# EAGLE design D_cmp (EAGLE 7.2.0)
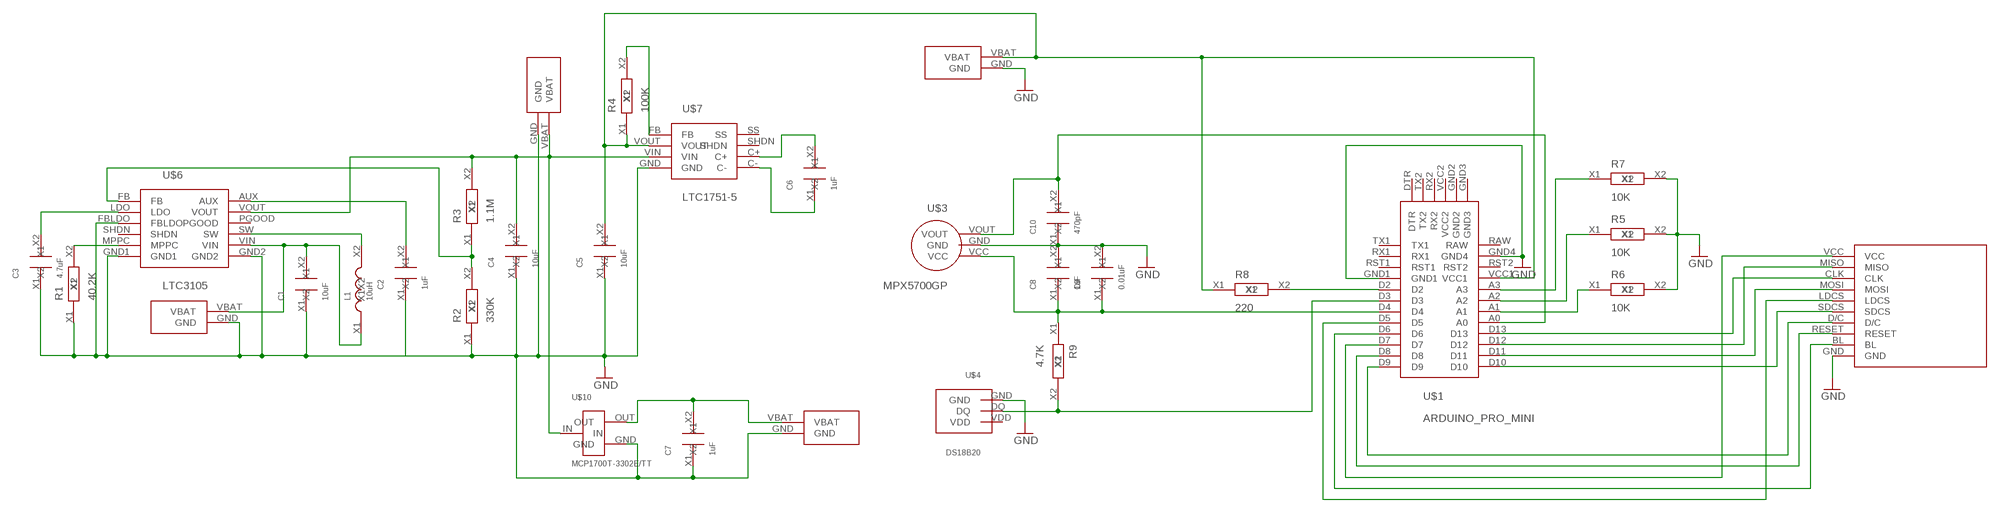
[diagram p0: schematic, sheet 1]

## Parts
C1  10uF  C_SMD_2.1X1.25  [SMD_2.1X1.25]
C2  1uF  C_SMD_2.1X1.25  [SMD_2.1X1.25]
C3  4.7uF  C_SMD_2.1X1.25  [SMD_2.1X1.25]
C4  10uF  C_SMD_2.1X1.25  [SMD_2.1X1.25]
C5  10uF  C_SMD_2.1X1.25  [SMD_2.1X1.25]
C6  1uF  C_SMD_2.1X1.25  [SMD_2.1X1.25]
C7  1uF  C_SMD_2.1X1.25  [SMD_2.1X1.25]
C8  1uF  C_SMD_2.1X1.25  [SMD_2.1X1.25]
C9  0.01uF  C_SMD_2.1X1.25  [SMD_2.1X1.25]
C10  470pF  C_SMD_2.1X1.25  [SMD_2.1X1.25]
L1  10uH  L_SMD_2.1X1.25  [SMD_2.1X1.25]
R1  40.2K  R_SMD_2.1X1.25  [SMD_2.1X1.25]
R2  330K  R_SMD_2.1X1.25  [SMD_2.1X1.25]
R3  1.1M  R_SMD_2.1X1.25  [SMD_2.1X1.25]
R4  100K  R_SMD_2.1X1.25  [SMD_2.1X1.25]
R5  10K  R_SMD_2.1X1.25  [SMD_2.1X1.25]
R6  10K  R_SMD_2.1X1.25  [SMD_2.1X1.25]
R7  10K  R_SMD_2.1X1.25  [SMD_2.1X1.25]
R8  220  R_SMD_2.1X1.25  [SMD_2.1X1.25]
R9  4.7K  R_SMD_2.1X1.25  [SMD_2.1X1.25]
U$1  ARDUINO_PRO_MINI  [ARDUINO_PRO_MINI]
U$2  TFT_LCD  [TFT_LCD]
U$3  MPX5700GP  [MPX5700GP]
U$4  DS18B20  [DS18B20]
U$5  BAT_PLUG  [BAT_PLUG]
U$6  LTC3105  [LTC3105]
U$7  LTC1751-5  [LTC1751-5]
U$8  BAT_PLUG  [BAT_PLUG]
U$9  BAT_PLUG  [BAT_PLUG]
U$10  MCP1700T-3302E/TT  [MCP1700T-3302E/TT]
U$11  BAT_PLUG  [BAT_PLUG]

## Nets
GND: C1.X1 C2.X1 C3.X1 C4.X1 C5.X1 C7.X1 C8.X2 C9.X2 C10.X1 R1.X1 R2.X1 R5.X2 R6.X2 R7.X2 U$1.GND1 U$1.GND4 U$2.GND U$3.GND U$4.GND U$5.GND U$6.FBLDO U$6.GND1 U$6.GND2 U$7.GND U$8.GND U$9.GND U$10.GND U$11.GND
N$1: U$1.D9 U$2.D/C
N$2: U$1.D8 U$2.RESET
N$3: U$1.D10 U$2.SDCS
N$4: U$1.D11 U$2.MOSI
N$5: U$1.D12 U$2.MISO
N$6: U$1.D13 U$2.CLK
N$7: U$1.D7 U$2.VCC
N$8: U$1.D6 U$2.BL
N$10: R6.X1 U$1.A1
N$11: R5.X1 U$1.A2
N$12: R7.X1 U$1.A3
N$14: R8.X2 U$1.D2
N$16: C8.X1 C9.X1 R9.X1 U$1.D4 U$3.VCC
N$17: R9.X2 U$1.D3 U$4.DQ
N$18: C10.X2 U$1.A0 U$3.VOUT
N$23: R1.X2 U$6.MPPC
N$26: C3.X2 U$6.LDO
N$28: L1.X2 U$6.SW
N$29: C2.X2 U$6.AUX
N$30: R2.X2 R3.X1 U$6.FB
N$31: C1.X2 L1.X1 U$6.VIN U$8.VBAT
N$32: C4.X2 R3.X2 U$6.VOUT U$7.VIN U$9.VBAT U$10.IN
N$33: C5.X2 R4.X1 R8.X1 U$1.VCC1 U$5.VBAT U$7.VOUT
N$34: R4.X2 U$7.FB
N$35: C6.X1 U$7.C-
N$36: C6.X2 U$7.C+
N$37: C7.X2 U$10.OUT U$11.VBAT
N$43: U$1.D5 U$2.LDCS
Unconnected: U$1.DTR U$1.GND2 U$1.GND3 U$1.RAW U$1.RST1 U$1.RST2 U$1.RX1 U$1.RX2 U$1.TX1 U$1.TX2 U$1.VCC2 U$4.VDD U$6.PGOOD U$6.SHDN U$7.SHDN U$7.SS

## Library data of the parts
C1-C10 = MyPowerComponents:C_SMD_2.1X1.25
L1 = MyPowerComponents:L_SMD_2.1X1.25
R1-R9 = MyPowerComponents:R_SMD_2.1X1.25
U$1 = MyDuino:ARDUINO_PRO_MINI
U$2 = MyDuino:TFT_LCD
U$3 = MyDuino:MPX5700GP
U$4 = MyDuino:DS18B20
U$5 U$8 U$9 U$11 = MyDuino:BAT_PLUG
U$6 = MyDuino:LTC3105
U$7 = MyPowerComponents:LTC1751-5
U$10 = MyDuino:MCP1700T-3302E/TT

## Board
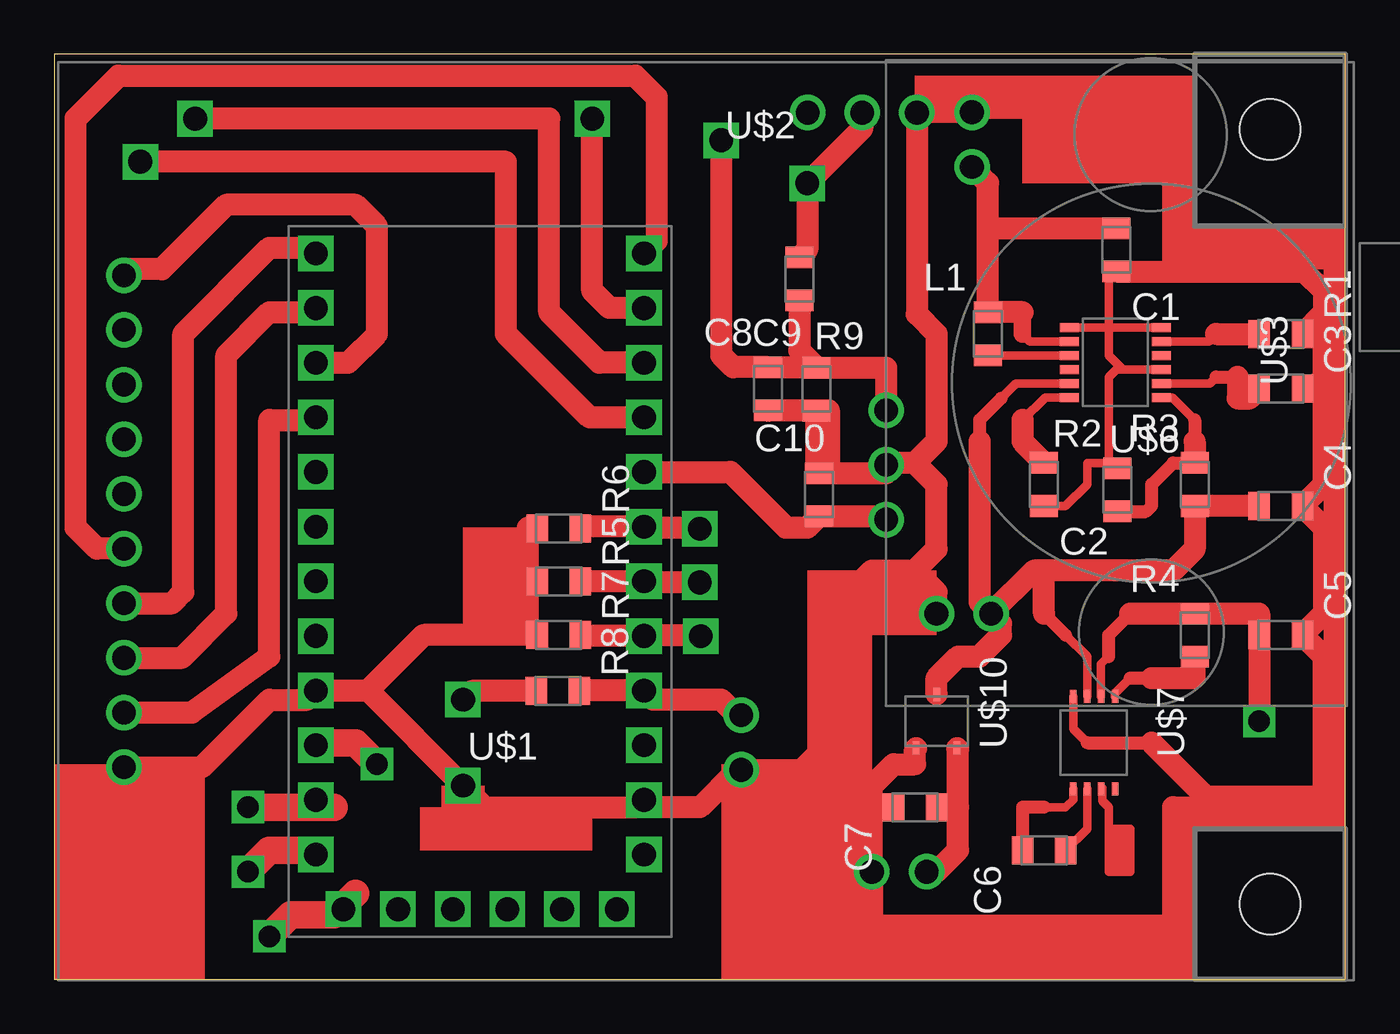
[diagram p1: board, top side]
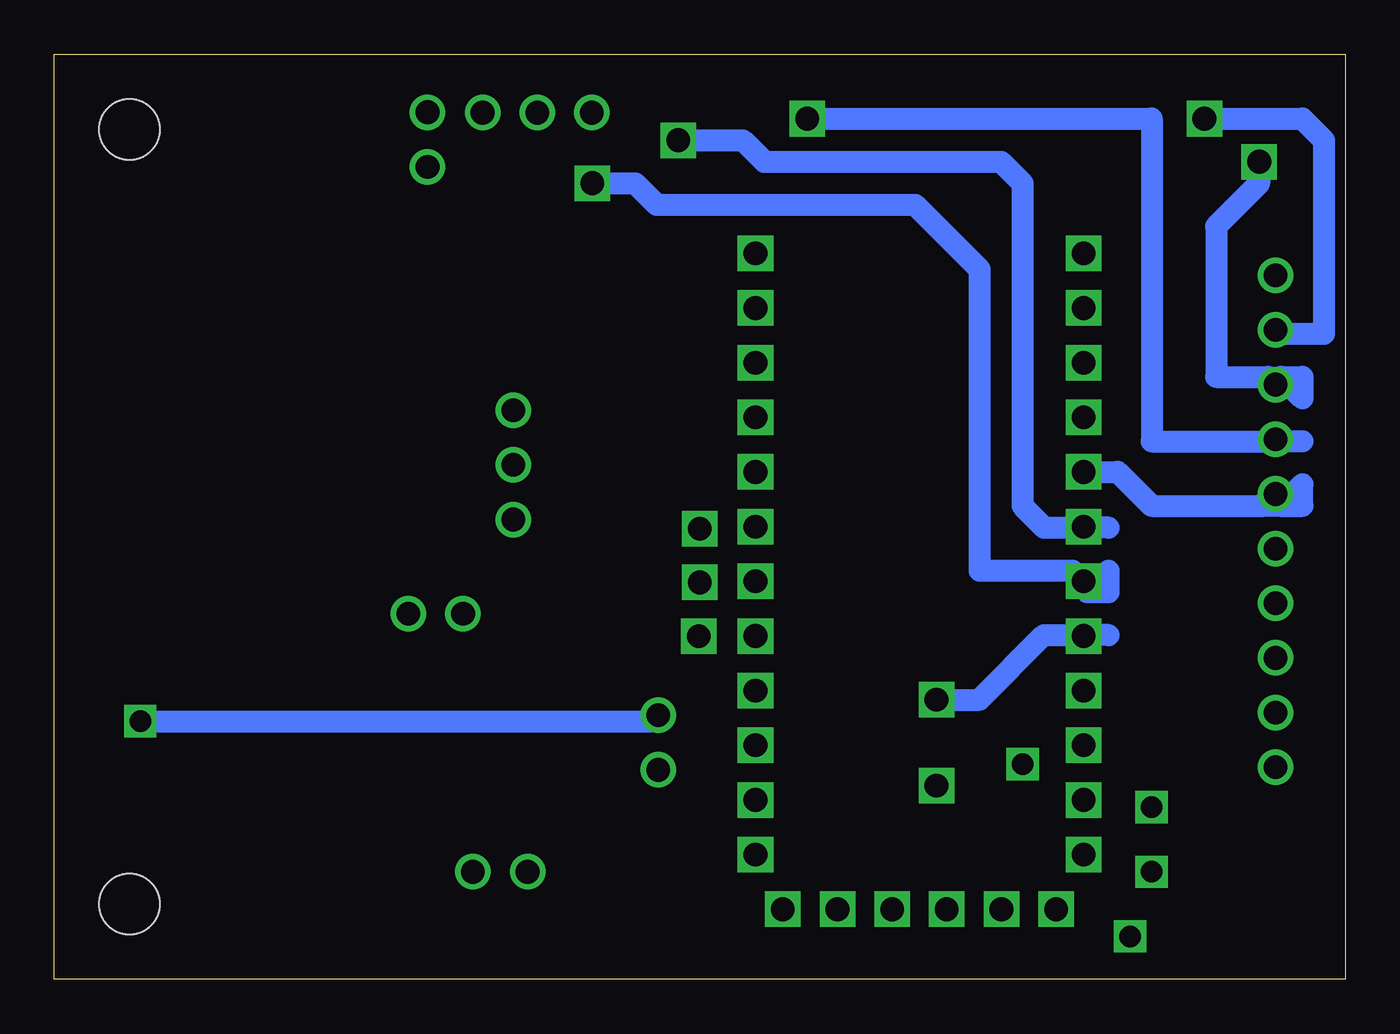
[diagram p2: board, bottom side, seen from below]

Size 60 x 43 mm. Coordinates in mm from the lower left corner, seen from the top.
Outline: 0,0 60,0 60,43 0,43 0,0
Copper layers (1*16): Top 0.035mm / dielectric 1.5mm / Bottom 0.035mm
Design rules "default": minimum track width 10mil, minimum drill 24mil, track to track 8mil, track to pad 8mil, pad to pad 8mil, via to via 8mil, smd to smd 8mil, copper to edge 40mil, drill to drill 8mil, minimum pad ring 10mil, minimum via ring 8mil, stop-mask expansion 4mil, vias tented up to drill 0mil, thermal gap 10mil
Holes 2.8 mm at 56.5,39.5 56.5,3.5

### Footprints (pad centres in the part's own frame; a part is rotated, then mirrored left to right if it is on the bottom)
SMD_2.1X1.25 = smd 1.3 x 1: X1 0,1; X2 0,-1
ARDUINO_PRO_MINI = drill 1.1 square: A0 -7.62,-6.35; A1 -7.62,-3.81; A2 -7.62,-1.27; A3 -7.62,1.27; D2 7.62,1.27; D3 7.62,-1.27; D4 7.62,-3.81; D5 7.62,-6.35; D6 7.62,-8.89; D7 7.62,-11.43; D8 7.62,-13.97; D9 7.62,-16.51; D10 -7.62,-16.51; D11 -7.62,-13.97; D12 -7.62,-11.43; D13 -7.62,-8.89; DTR 6.35,13.97; GND1 7.62,3.81; GND2 -3.81,13.97; GND3 -6.35,13.97; GND4 -7.62,8.89; RAW -7.62,11.43; RST1 7.62,6.35; RST2 -7.62,6.35; RX1 7.62,8.89; RX2 1.27,13.97; TX1 7.62,11.43; TX2 3.81,13.97; VCC1 -7.62,3.81; VCC2 -1.27,13.97
TFT_LCD = drill 1.1: BL -57.15,12.7; CLK -57.15,27.94; D/C -57.15,17.78; GND -57.15,10.16; LDCS -57.15,22.86; MISO -57.15,30.48; MOSI -57.15,25.4; RESET -57.15,15.24; SDCS -57.15,20.32; VCC -57.15,33.02
MPX5700GP = drill 1.1: GND 3.81,0; VCC 1.27,0; VOUT 6.35,0
DS18B20 = drill 1.1: DQ 0,0; GND 0,2.54; VDD 0,-2.54
BAT_PLUG = drill 1.1: GND 0,0; VBAT 0,2.54
LTC3105 = smd 0.89 x 0.42: AUX 3.82,1.95; FB -0.45,1.95; FBLDO -0.45,0.65; GND1 -0.45,-1.3; GND2 3.82,-1.3; LDO -0.45,1.3; MPPC -0.45,-0.65; PGOOD 3.82,0.65; SHDN -0.45,0; SW 3.82,0; VIN 3.82,-0.65; VOUT 3.82,1.3
LTC1751-5 = smd 0.61 x 0.305: C+ 2.15,0; C- 2.15,-0.65; FB -2.15,1.3; GND -2.15,-0.65; SHDN 2.15,0.65; SS 2.15,1.3; VIN -2.15,0; VOUT -2.15,0.65
MCP1700T-3302E/TT = smd 0.61 x 0.305: GND 1.25,-0.95; IN -1.25,0; OUT 1.25,0.95

### Placement (x,y rotation side)
C1  49.35,33.9 180 top
C2  46,23 180 top
C3  57,27.45 270 top
C4  57,22 270 top
C5  57,16 270 top
C6  46,6 90 top
C7  40,8 90 top
C8  33.18,27.45 0 top
C9  35.43,27.43 0 top
C10  35.53,22.53 0 top
L1  43.4,30 0 top
R1  57,30 270 top
R2  49.4,22.75 0 top
R3  53,23 0 top
R4  53,16 0 top
R5  23.45,18.5 270 top
R6  23.45,20.95 270 top
R7  23.44,16 270 top
R8  23.41,13.4 270 top
R9  34.63,32.55 180 top
U$1  19.79,17.23 180 top
U$2  60.39,-0.3 0 top
U$3  38.66,27.72 270 top
U$4  37.55,40.28 270 top
U$5  31.93,9.74 0 top
U$6  51,29 180 top
U$7  48,11 270 top
U$8  42.65,40.3 180 top
U$9  41,17 270 top
U$10  41,12 270 top
U$11  38,5 270 top

### Tracks (layer width: path | path; a pad name or v marks a point on that pad's centre or on a via)
GND  (via drill 1.1)
  Top 0.406: U$6.GND2 49,30.3 | 49,30.3 U$6.GND1 | 49,24.15 49,28 49.35,28.35 U$6.FBLDO 49.65,28.35 49,29 49,30.3 | 49,24.15 R2.X1 | 49,30.3 49,32.55 C1.X1 | C2.X1 47,22 48,23 48,24 48.85,24 49,24.15 | U$7.GND 47.35,11.65 48,11
  Top 0.61: 48,11 51,11
  Top 1.016: U$2.GND 6.86,9.86 10,13 11.75,13 U$1.GND1 14.58,13.42 | 14.58,13.42 v19,9 20,8 27.07,8 U$1.GND4 27.75,8 30,8 31.74,9.74 U$5.GND 34.74,9.74 36,11 36,17 38,19 40,19 | R6.X2 22.05,20.95 22,21 22,18.95 R5.X2 22.45,18.45 22,18 22,16.44 R7.X2 17.16,16 14.58,13.42 | 36,24 36,26.45 C8.X2 33.18,26.43 C9.X2 35.43,23.53 C10.X1 38.66,23.53 U$3.GND 38.75,24 40,24 | 40,19 41,20 41,23 40,24 | 40,24 41,25 41,30 40.09,30.91 U$4.GND 40.11,40.3 U$8.GND 43.35,41 51,41 52,40 52,33 51.9,32.9 C1.X1 58.1,32.9 59,32 59,31 | 59,31 R1.X1 | C3.X1 58.45,27.45 59,28 | 59,28 59,31 | 59,28 59,23 C4.X1 59,21 59,17 C5.X1 59,15 59,8 54,8 53.5,8.5 | 51,11 53.5,8.5 | 53.5,8.5 53,8 52,8 52,1 38,1 U$11.GND 38,8 | U$9.GND 41,18 40,19 | C7.X1 38,8 | 38,8 38,9 39,10 40,10 40,10.7 U$10.GND
N$1
  Top 1.016: U$2.D/C 5.48,17.48 6,18 6,30 10,34 11.91,34 U$1.D9
N$2
  Top 1.016: U$2.RESET 5.94,14.94 8,17 8,29 10,31 12,31 12,31.03 U$1.D8
N$3
  Top 1.016: U$2.SDCS 1.98,20.02 1,21 1,40 3,42 27,42 28,41 28,34.33 U$1.D10
N$4  (via drill 1.1)
  Top 1.016: U$1.D11 25.8,31.2 25,32 v25,40
  Bottom 1.016: v25,40 9,40 9,25 3.34,25 U$2.MOSI
N$5  (via drill 1.1)
  Top 1.016: U$1.D12 25.34,28.66 23,31 23,40 v6.55,40
  Bottom 1.016: v6.55,40 2,40 1,39 1,30 3.06,30 U$2.MISO
N$6  (via drill 1.1)
  Top 1.016: U$1.D13 24.88,26.12 21,30 21,38 v4,38
  Bottom 1.016: v4,38 4,37 6,35 6,28 3.6,28 U$2.CLK
N$7
  Top 1.016: U$1.D7 13.66,28.66 15,30 15,35 14,36 8,36 5,33 3.52,33 U$2.VCC
N$8
  Top 1.016: U$2.BL 6.4,12.4 10,15 10,26 12.05,26 U$1.D6
N$10
  Top 1.016: U$1.A1 24.54,21.04 R6.X1
N$11
  Top 1.016: U$1.A2 R5.X1
N$12
  Top 1.016: U$1.A3 24.48,15.96 R7.X1
N$13  (via drill 1.1)
  other vias: 19,13
N$14  (via drill 1.1)
  Top 1.016: R8.X2 19.4,13.4 v19,13
  Bottom 1.016: v19,13 17,13 14,16 12.21,16 U$1.D2
N$15  (via drill 1)
  Top 1.27: v10,2 11,3 13,3 14,4
N$16  (via drill 1.1)
  Top 1.016: C9.X1 38.66,28.43 U$3.VCC | C9.X1 35.43,28.45 C8.X1 31.55,28.45 31,29 v31,39 | R9.X1 34.63,29.23 C9.X1
  Bottom 1.016: v31,39 28,39 27,38 16,38 15,37 15,22 14,21 12.21,21 U$1.D4
N$17  (via drill 1.1)
  Top 1.016: U$4.DQ 37.55,39.55 v35,37 35,33.92 R9.X2
  Bottom 1.016: v35,37 33,37 32,36 20,36 17,33 17,19 12.67,19 U$1.D3
N$18
  Top 1.016: U$3.VOUT 38.66,21.53 C10.X2 35,21 34,21 31.42,23.58 U$1.A0
N$19  (via drill 1.1)
  other vias: 30.05,15.95
N$20  (via drill 1.1)
  other vias: 30,18.45
N$21  (via drill 1.1)
  other vias: 30,20.95
N$22
  Top 1.016: 27,21 28,21 29,21 30,21
N$23
  Top 0.406: U$6.MPPC 53.65,29.65 54,30
  Top 1.016: 54,30 R1.X2
N$24
  Top 1.016: 30.05,18.45 27.05,18.45
N$25
  Top 1.016: 27,16 30,16
N$26
  Top 0.406: U$6.LDO 53.7,27.7 54,28
  Top 0.61: 54,28 55,28
  Top 1.016: 55,28 55,27 55.55,27 C3.X2
N$27  (via drill 1)
  Top 1.27: 12,6 10,6 v9,5
N$28
  Top 0.406: U$6.SW L1.X2
N$29
  Top 0.406: U$6.AUX 46.05,27.05 45,26
  Top 1.016: 45,26 45,25 C2.X2
N$30
  Top 0.406: U$6.FB 51.95,27.05 53,26
  Top 0.61: 53,26 53,25 | R2.X2 50.75,21.75 51,22 51,23 52,24 R3.X1
  Top 1.016: 53,25 R3.X1
N$31
  Top 0.406: U$6.VIN 45.35,29.65 45,30
  Top 0.813: 45,30 45,31
  Top 1.016: 43.4,35 L1.X1 45,31 | 43.4,35 43.4,37.01 U$8.VBAT | C1.X2 43.5,34.9 43.4,35
N$32
  Top 0.406: U$6.VOUT 44.7,27.7 44,27 | U$7.VIN 48,15 47,16
  Top 0.61: 44,27 43,26 43,25 | 47,16 46,17
  Top 1.016: 43,25 43,17.54 U$9.VBAT | C4.X2 R3.X2 53,20 52,19 46,19 | 46,19 45.54,19 U$9.VBAT | 46,17 46,19 | U$10.IN 41,14 42,15 43,15 44,16 44,16.54 U$9.VBAT
N$33  (via drill 1)
  Top 0.406: U$7.VOUT 48.65,14.65 49,15
  Top 0.61: 49,15 49,16 50,17
  Top 1.016: R8.X1 24.41,13.42 U$1.VCC1 27.83,13 31,13 31.72,12.28 U$5.VBAT | 50,17 R4.X1 56,17 C5.X2 v56,12
  Bottom 1.016: v56,12 32.21,12 U$5.VBAT
N$34
  Top 0.406: U$7.FB 49.3,13.3 50,14
  Top 0.61: 50,14 51,14
  Top 1.016: 51,14 53,14 R4.X2
N$35
  Top 0.406: U$7.C- 47.35,8.35 47,8 46,8
  Top 0.61: 46,8 45,8 C6.X1
N$36
  Top 0.406: U$7.C+ 48,7 C6.X2
N$37
  Top 1.016: U$11.VBAT 41,5 42,6 42,8 | 42,8 C7.X2 | 42,8 42,10.7 U$10.OUT
N$38  (via drill 1)
  Top 1.27: v9,8 13,8
N$39  (via drill 1)
  Top 1.27: 12,11 14,11 v15,10
N$40
  Top 0.406: 48.7,8.9 48.7,8.3 49,8 49,7 | 49,7 49,5 50,5 50,7 49,7
N$41
  Bottom 1.016: 3,28 2,28 2,27 3,28
N$42
  Bottom 1.016: 2,25 3,25
N$43
  Bottom 1.016: 3,22 2,22 2,23 3,22 | U$1.D5 10.58,23.58 9,22 4,22 3.8,22 | 3.8,22 U$2.LDCS | 3,22 3.8,22
N$44
  Bottom 1.016: 11,21 12,21
N$45
  Bottom 1.016: 12,18 11,18 11,19 12,18
N$46
  Bottom 1.016: 11,16 12,16
(copper drawn outside any net)
  shapes: Top area x20